# Altium schematic sheet Ctrol1.SchDoc
size A4
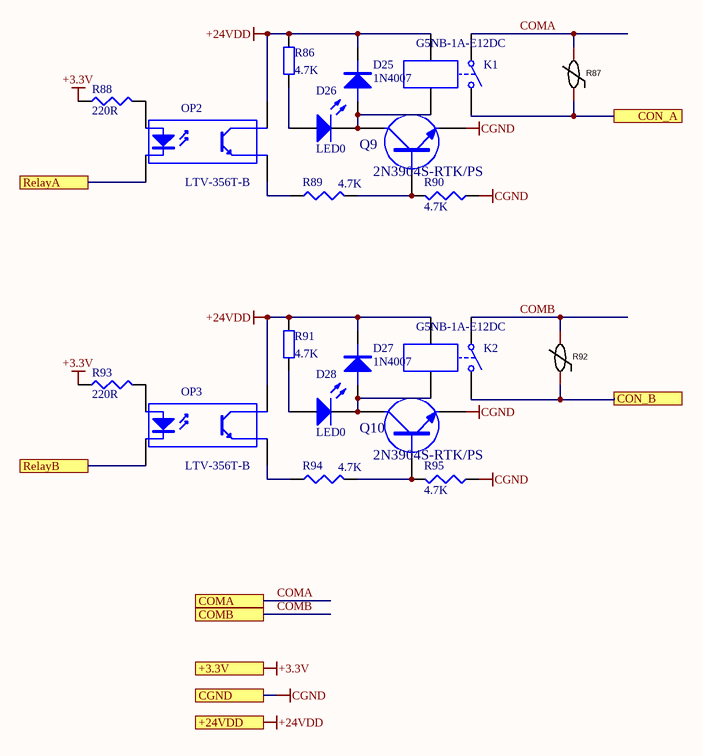
[diagram p0: Ctrol1.SchDoc]

## Parts
D25  1N4007  [DO-213AB]
D26  LED0  [0805LED]
D27  1N4007  [DO-213AB]
D28  LED0  [0805LED]
K1  G5NB-1A-E12DC  [G5NB-1A-E]
K2  G5NB-1A-E12DC  [G5NB-1A-E]
OP2  LTV-356T-B  [TLV-356]
OP3  LTV-356T-B  [TLV-356]
Q9  2N3904S-RTK/PS  [SOT-23]
Q10  2N3904S-RTK/PS  [SOT-23]
R86  4.7K  [0805R]
R87  RM10D471KD14E100  [YAMINGDIANZU]  (value not drawn)
R88  220R  [0805R]
R89  4.7K  [0805R]
R90  4.7K  [0805R]
R91  4.7K  [0805R]
R92  RM10D471KD14E100  [YAMINGDIANZU]  (value not drawn)
R93  220R  [0805R]
R94  4.7K  [0805R]
R95  4.7K  [0805R]

## Ports
+3.3V, +24VDD, CGND, COMA, COMB, CON_A, CON_B, RelayA, RelayB

## Nets
+3.3V: R88.1 R93.1 ; port +3.3V
+24VDD: D25.2(K) D27.2(K) K1.1 K2.1 OP2.4(C) OP3.4(C) R86.1 R91.1 ; port +24VDD
CGND: Q9.2(E) Q10.2(E) R90.1 R95.1 ; port CGND
COMA: K1.2 R87.2 ; port COMA
COMB: K2.2 R92.2 ; port COMB
CON_A: K1.3 R87.1 ; port CON_A
CON_B: K2.3 R92.1 ; port CON_B
RelayA: OP2.2(K) ; port RelayA
RelayB: OP3.2(K) ; port RelayB
NetD25_1: D25.1(A) D26.2(K) K1.4 Q9.3(C)
NetD26_1: D26.1(A) R86.2
NetD27_1: D27.1(A) D28.2(K) K2.4 Q10.3(C)
NetD28_1: D28.1(A) R91.2
NetOP2_1: OP2.1(A) R88.2
NetOP2_3: OP2.3(E) R89.1
NetOP3_1: OP3.1(A) R93.2
NetOP3_3: OP3.3(E) R94.1
NetQ9_1: Q9.1(B) R89.2 R90.2
NetQ10_1: Q10.1(B) R94.2 R95.2

## Library data of the parts
D25 D27 = DIODE: 品牌： TWGMC(台湾迪嘉) 型号： 1N4007 二极管配置：独立式 直流反向耐压(Vr)：1kV 平均整流电流(Io)：1A 正向压降(Vf)：1.1V@1A 二极管配置：独立式 直流反向耐压(Vr)：1kV 平均整流电流(Io)：1A 正向压降(Vf)：1.1V@1A
D26 D28 = LED0: 品牌： 国星光电 型号： NCD0805B2 发光颜色：蓝灯 贴片LED；0805蓝色；2012蓝色；透镜颜色：无色透明；发光角度：130°；功率：72mW；工作温度：-30℃~+85℃；; Published: 8-Jun-2000; LatestRevisionDate: 08-Jul-2005; LatestRevisionNote: Mech Layer 1 removed.; PackageReference: LED-0; Publisher: Altium Limited; PackageDescription: LED; 2 Leads
K1 K2 = Relay-G5NB-1A-E: 品牌： OMRON(欧姆龙) 型号： G5NB-1A-E DC12 封装： 插件,7x20.4mm; Published: 24-Mar-1999; LatestRevisionDate: 17-Jul-2002; LatestRevisionNote: Re-released for DXP Platform.; PackageReference: MODULE4; Publisher: Altium Limited
OP2 OP3 = OPTOISO1: 品牌名称 / LITEON(光宝) / 商品型号 / LTV-356T-B / 商品编号 / C10804 / 商品封装 / SOP-4-2.54mm
Q9 Q10 = 8050: 品牌： KEC   型号： 2N3904S-RTK/PS 晶体管类型：NPN 集射极击穿电压(Vceo)：40V 集电极电流(Ic)：200mA 功率(Pd)：350mW 直流电流增益(hFE@Ic,Vce)：100@10mA,1V NPN,Vceo=40V,Ic=200mA
R86 R91 = Res2: 品牌： UNI-ROYAL(厚声) 型号： 0805W8F4701T5E 电阻类型：厚膜电阻 阻值：4.7kΩ 精度：±1% 功率：125mW 温度系数：±100ppm/℃; Value: 10K; Published: 8-Jun-2000; LatestRevisionDate: 17-Jul-2002; LatestRevisionNote: Re-released for DXP Platform.; PackageReference: AXIAL-0.4; Publisher: Altium Limited; PackageDescription: Axial Device, Thru-Hole; 2 Leads; 0.4 in Pin Spacing
R87 R92 = RM10D471KD14E100: Manufacturer: Dersonic(德尔创); Add into BOM: yes; Varistor Voltage: 470V; Clamping Voltage: 775V; Allowable Voltage (DC): 385V; Allowable Voltage (AC): 300V; Peak Current: 2.5kA; Maximum Energy: 67J; Typical Capatitance: 210pF@1kHz; Rated Wattage: 400mW; Symbol: RM10D471KD14E100; Device: RM10D471KD14E100; LCSC Part Name: 钳位电压775V 67焦耳 插件压敏电阻; Supplier Part: C2974809; Manufacturer Part: RM10D471KD14E100; Supplier Footprint: 插件,P=7.5mm; JLCPCB Part Class: Extended Part; Datasheet: https://atta.szlcsc.com/upload/public/pdf/source/20220216/7E2B8E32815A179BCD41409596CBB68C.pdf; Supplier: LCSC; Convert to PCB: yes
R88 R93 = RES1: 品牌： UNI-ROYAL(厚声) 型号： 0805W8J0221T5E 电阻类型：厚膜电阻 阻值：220Ω 精度：±5% 功率：125mW 温度系数：±100ppm/℃
R89 R90 R94 R95 = RES1: 品牌： UNI-ROYAL(厚声) 型号： 0805W8F4701T5E 电阻类型：厚膜电阻 阻值：4.7kΩ 精度：±1% 功率：125mW 温度系数：±100ppm/℃